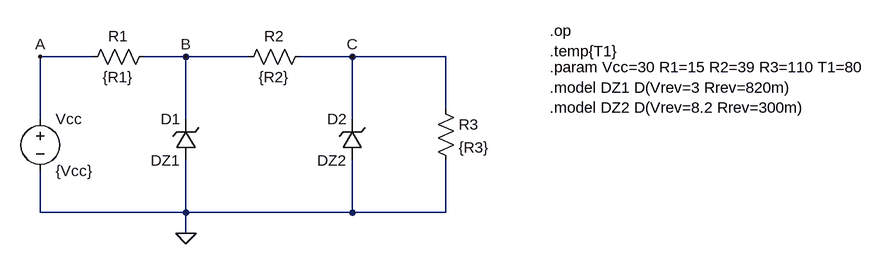
[diagram p0: schematic Lab EaD 01 F.asc]
Lab EaD 01 F.asc, the LTspice schematic file:
Version 4
SHEET 1 1224 680
WIRE -16 48 -96 48
WIRE 128 48 64 48
WIRE 224 48 128 48
WIRE 384 48 304 48
WIRE 528 48 384 48
WIRE 528 128 528 48
WIRE -96 144 -96 48
WIRE 128 144 128 48
WIRE 384 144 384 48
WIRE -96 288 -96 224
WIRE 128 288 128 208
WIRE 128 288 -96 288
WIRE 384 288 384 208
WIRE 384 288 128 288
WIRE 528 288 528 208
WIRE 528 288 384 288
WIRE 128 320 128 288
FLAG 128 320 0
FLAG -96 48 A
FLAG 128 48 B
FLAG 384 48 C
SYMBOL voltage -96 128 R0
SYMATTR InstName Vcc
SYMATTR Value {Vcc}
SYMBOL zener 144 208 R180
WINDOW 0 24 64 Left 2
WINDOW 3 24 0 Left 2
SYMATTR InstName D1
SYMATTR Value DZ1
SYMBOL res 80 32 R90
WINDOW 0 0 56 VBottom 2
WINDOW 3 32 56 VTop 2
SYMATTR InstName R1
SYMATTR Value {R1}
SYMBOL res 320 32 R90
WINDOW 0 0 56 VBottom 2
WINDOW 3 32 56 VTop 2
SYMATTR InstName R2
SYMATTR Value {R2}
SYMBOL zener 400 208 R180
WINDOW 0 24 64 Left 2
WINDOW 3 24 0 Left 2
SYMATTR InstName D2
SYMATTR Value DZ2
SYMBOL res 512 112 R0
SYMATTR InstName R3
SYMATTR Value {R3}
TEXT 688 8 Left 2 !.op\n.temp{T1}
TEXT 688 64 Left 2 !.param Vcc=30 R1=15 R2=39 R3=110 T1=80\n.model DZ1 D(Vrev=3 Rrev=820m)\n.model DZ2 D(Vrev=8.2 Rrev=300m)

The netlist it stands for:
* Lab EaD 01 F.asc
Vcc A 0 {Vcc}
D1 0 B DZ1
R1 B A {R1}
R2 C B {R2}
D2 0 C DZ2
R3 C 0 {R3}
.model D D
.lib standard.dio
.op
.temp{T1}
.param Vcc=30 R1=15 R2=39 R3=110 T1=80
.model DZ1 D(Vrev=3 Rrev=820m)
.model DZ2 D(Vrev=8.2 Rrev=300m)
.backanno
.end

* Results of the author's LTspice run, read from the files saved beside the schematic
* Operating Point:
*   V(a) = 30 V
*   V(b) = 4.377 V
*   V(c) = 3.231 V
*   I(D2) = -3.234 pA
*   I(D1) = -1.679 A
*   I(R3) = 29.37 mA
*   I(R2) = -29.37 mA
*   I(R1) = -1.708 A
*   I(Vcc) = -1.708 A
* From the log:
*   Semiconductor Device Operating Points:
*                           --- Diodes ---
*   Name:      d2          d1
*   Model:     dz2         dz1
*   Id:     -3.23e-12   -1.68e+00
*   Vd:     -3.23e+00   -4.38e+00
*   Req:     1.00e-12    1.22e+00
*   CAP:     0.00e+00    0.00e+00